# Altium schematic sheet connectorOut.SchDoc
size A4
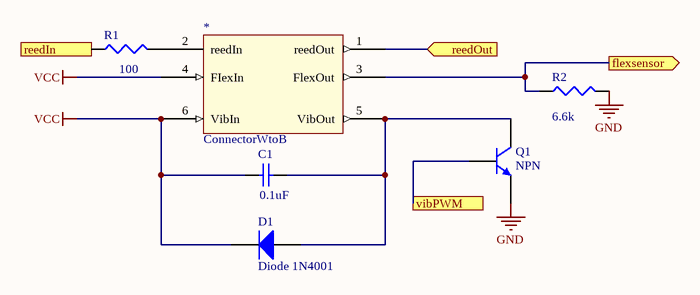
[diagram p0: connectorOut.SchDoc]

## Parts
*  ConnectorWtoB  [Connector_wire_to_PCB]
C1  value 0.1uF  [RAD-0.3]  (hidden comment: Cap)
D1  Diode 1N4001  [DO-41]
Q1  NPN  [TO-226-AA]
R1  value 100  [J1-0603]
R2  value 6.6k  [J1-0603]  (hidden comment: Res3)

## Ports
flexsensor (out), reedIn, reedOut (in), vibPWM

## Nets
GND: Q1.3(E) R2.2
VCC: *.4(FIexIn) *.6(VibIn) C1.1 D1.2(K)
flexsensor: *.3(FlexOut) R2.1 ; port flexsensor
reedIn: R1.1 ; port reedIn
reedOut: *.1(reedOut) ; port reedOut
vibPWM: Q1.2(B) ; port vibPWM
Net*_2: *.2(reedIn) R1.2
Net*_5: *.5(VibOut) C1.2 D1.1(A) Q1.1(C)

## Library data of the parts
C1 = Cap: Capacitor; Published: 8-Jun-2000; LatestRevisionDate: 17-Jul-2002; LatestRevisionNote: Re-released for DXP Platform.; PackageReference: RAD-0.3; Publisher: Altium Limited; PackageDescription: Radial Cap, Thru-Hole; 2 Leads; 0.3 in Pin Spacing
D1 = Diode 1N4001: 1 Amp General Purpose Rectifier; Published: 8-Jun-2000; LatestRevisionDate: 17-Jul-2002; LatestRevisionNote: Re-released for DXP Platform.; DatasheetVersion: 1998; PackageVersion: Aug-1999; PackageReference: DO-41; Publisher: Altium Limited; PackageDescription: Diode, Axial; Body 5.2 x 2.7 mm (LxDia. max), Lead Dia. 0.86 mm (max); Code_JEDEC: DO-204-AL; ComponentLink1Description: Manufacturer Link; ComponentLink1URL: http://www.fairchildsemi.com/; ComponentLink2Description: Datasheet; ComponentLink2URL: http://www.fairchildsemi.com/ds/1N%2F1N4001.pdf
Q1 = NPN: NPN Bipolar Transistor; Published: 8-Jun-2000; LatestRevisionDate: 17-Jul-2002; LatestRevisionNote: Re-released for DXP Platform.; PackageReference: TO-226-AA; Publisher: Altium Limited; PackageDescription: TO, Flat Index; 3 In-Line, Axial Leads; Body Dia. 4.8mm; Leads 0.55 x 0.51 mm (max); Code_JEDEC: TO-226-AA
R1 R2 = Res3: Resistor; Published: 8-Jun-2000; LatestRevisionDate: 29-May-2009; LatestRevisionNote: IPC-7351 Footprint Added.; PackageReference: J1-0603; Publisher: Altium Limited; PackageDescription: Chip Resistor